# EAGLE design ADXL345_Eval_Board-v11 (EAGLE 5.01)
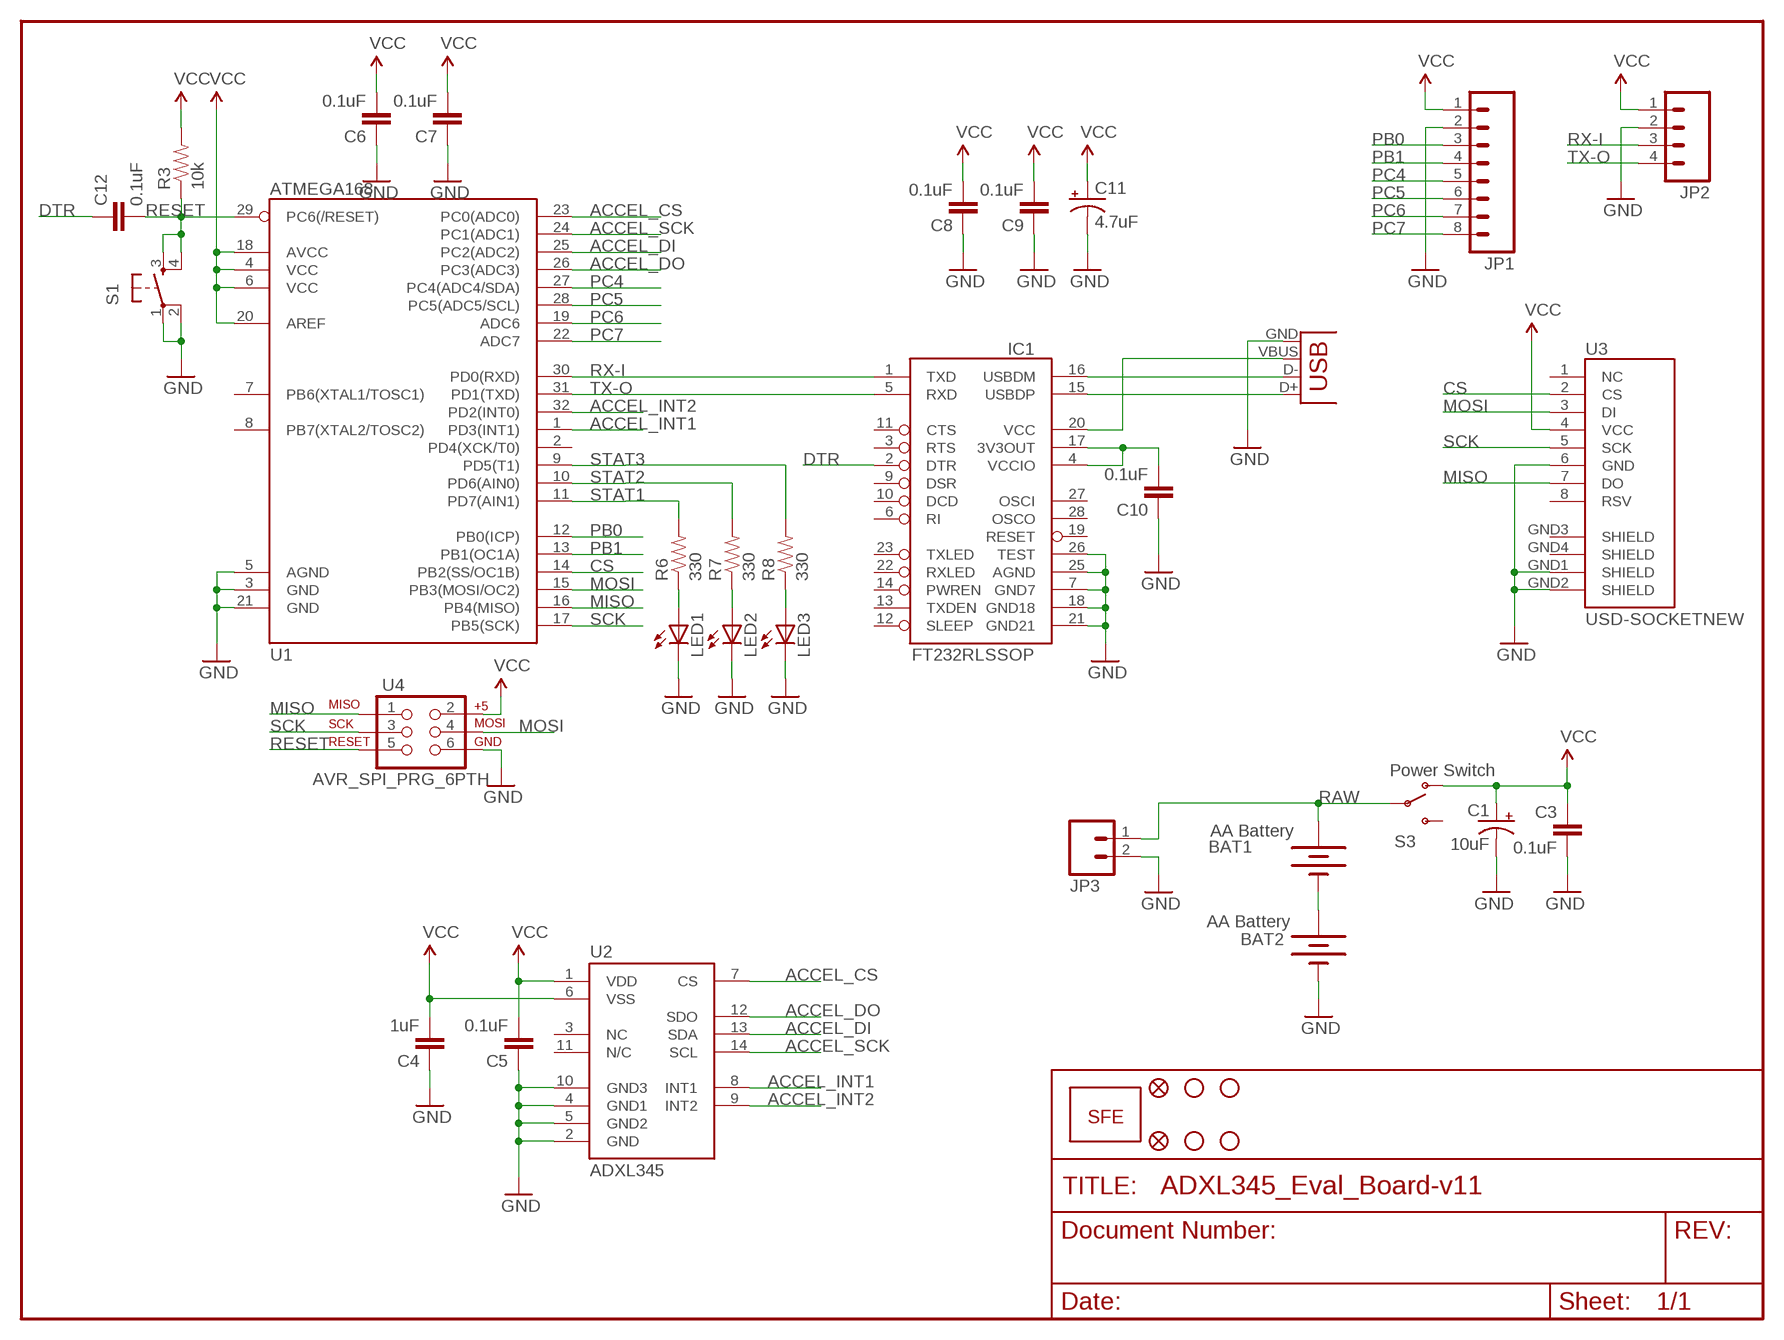
[diagram p0: schematic, sheet 1]

## Parts
BAT1  AA Battery  BATTERYAA  [BATTERY-AA]
BAT2  AA Battery  BATTERYAA  [BATTERY-AA]
C1  10uF  CAP_POL1206  [EIA3216]
C3  0.1uF  CAP0603-CAP  [0603-CAP]
C4  1uF  CAP0805  [0805]
C5  0.1uF  CAP0603-CAP  [0603-CAP]
C6  0.1uF  CAP0603-CAP  [0603-CAP]
C7  0.1uF  CAP0603-CAP  [0603-CAP]
C8  0.1uF  CAP0603-CAP  [0603-CAP]
C9  0.1uF  CAP0603-CAP  [0603-CAP]
C10  0.1uF  CAP0603-CAP  [0603-CAP]
C11  4.7uF  CAP_POL7343  [EIA7343]
C12  0.1uF  CAP0603-CAP  [0603-CAP]
IC1  FT232RLSSOP  [SSOP28DB]
JP1  M08  [1X08]
JP2  M04PTH  [1X04]
JP3  M02PTH  [1X02]
LED1  LED0603  [LED-0603]
LED2  LED0603  [LED-0603]
LED3  LED0603  [LED-0603]
R3  10k  RESISTOR0603-RES  [0603-RES]
R6  330  RESISTOR0603-RES  [0603-RES]
R7  330  RESISTOR0603-RES  [0603-RES]
R8  330  RESISTOR0603-RES  [0603-RES]
S1  TAC_SWITCHSMD  [TACTILE_SWITCH_SMD]
S3  Power Switch  SWITCH-SPSTSMD  [AYZ0202]
U1  ATMEGA168  [TQFP32-08]
U2  ADXL345  [LGA14]
U3  USD-SOCKETNEW  [MICRO-SD-SOCKET-PP]
U4  AVR_SPI_PRG_6PTH  [2X3]
U$1  LOGO-SFENEW  [SFE-NEW-WEBLOGO]
U$2  FIDUCIAL1X2  [FIDUCIAL-1X2]
U$3  FIDUCIAL1X2  [FIDUCIAL-1X2]
U$4  STAND-OFF  [STAND-OFF]
U$5  STAND-OFF  [STAND-OFF]
U$6  STAND-OFF  [STAND-OFF]
U$7  STAND-OFF  [STAND-OFF]
X1  USBSMD  [USB-MINIB]

## Nets
ACCEL_CS: U1.23(PC0(ADC0)) U2.7(CS)
ACCEL_DI: U1.25(PC2(ADC2)) U2.13(SDA)
ACCEL_DO: U1.26(PC3(ADC3)) U2.12(SDO)
ACCEL_INT1: U1.1(PD3(INT1)) U2.8(INT1)
ACCEL_INT2: U1.32(PD2(INT0)) U2.9(INT2)
ACCEL_SCK: U1.24(PC1(ADC1)) U2.14(SCL)
CS: U1.14(PB2(SS/OC1B)) U3.2(CS)
DTR: C12.1 IC1.2(DTR)
GND: BAT2.GND@1(-) C1.C(-) C3.2 C4.1 C5.1 C6.1 C7.1 C8.1 C9.1 C10.1 C11.C(-) IC1.7(GND7) IC1.18(GND18) IC1.21(GND21) IC1.25(AGND) IC1.26(TEST) JP1.2 JP2.2 JP3.2 LED1.C LED2.C LED3.C S1.1 S1.2 U1.3(GND) U1.5(AGND) U1.21(GND) U2.2(GND) U2.4(GND1) U2.5(GND2) U2.10(GND3) U3.6(GND) U3.GND1(SHIELD) U3.GND2(SHIELD) U4.6 X1.GND
MISO: U1.16(PB4(MISO)) U3.7(DO) U4.1
MOSI: U1.15(PB3(MOSI/OC2)) U3.3(DI) U4.4
N$1: LED1.A R6.1
N$2: BAT1.GND@1(-) BAT2.PWR@1(+)
N$3: LED2.A R7.1
N$4: IC1.20(VCC) X1.VBUS
N$5: LED3.A R8.1
N$6: IC1.16(USBDM) X1.D-
N$7: IC1.15(USBDP) X1.D+
N$8: C10.2 IC1.4(VCCIO) IC1.17(3V3OUT)
PB0: JP1.3 U1.12(PB0(ICP))
PB1: JP1.4 U1.13(PB1(OC1A))
PC4: JP1.5 U1.27(PC4(ADC4/SDA))
PC5: JP1.6 U1.28(PC5(ADC5/SCL))
PC6: JP1.7 U1.19(ADC6)
PC7: JP1.8 U1.22(ADC7)
RAW: BAT1.PWR@1(+) JP3.1 S3.2(P)
RESET: C12.2 R3.1 S1.3 S1.4 U1.29(PC6(/RESET)) U4.5
RX-I: IC1.1(TXD) JP2.3 U1.30(PD0(RXD))
SCK: U1.17(PB5(SCK)) U3.5(SCK) U4.3
STAT1: R6.2 U1.11(PD7(AIN1))
STAT2: R7.2 U1.10(PD6(AIN0))
STAT3: R8.2 U1.9(PD5(T1))
TX-O: IC1.5(RXD) JP2.4 U1.31(PD1(TXD))
VCC: C1.A(+) C3.1 C4.2 C5.2 C6.2 C7.2 C8.2 C9.2 C11.A(+) JP1.1 JP2.1 R3.2 S3.1(O) U1.4(VCC) U1.6(VCC) U1.18(AVCC) U1.20(AREF) U2.1(VDD) U2.6(VSS) U3.4(VCC) U4.2
Unconnected: IC1.3(RTS) IC1.6(RI) IC1.9(DSR) IC1.10(DCD) IC1.11(CTS) IC1.12(SLEEP) IC1.13(TXDEN) IC1.14(PWREN) IC1.19(RESET) IC1.22(RXLED) IC1.23(TXLED) IC1.27(OSCI) IC1.28(OSCO) S3.3(S) U1.2(PD4(XCK/T0)) U1.7(PB6(XTAL1/TOSC1)) U1.8(PB7(XTAL2/TOSC2)) U2.3(NC) U2.11(N/C) U3.1(NC) U3.8(RSV) U3.GND3(SHIELD) U3.GND4(SHIELD)

## Library data of the parts
BAT1 BAT2 = SparkFun:BATTERY: Battery Holders Various common sizes : AA, AAA, 20mm coin cell and 12mm coin cell.
C1 C11 = SparkFun:CAP_POL: Capacitor Polarized These are standard SMD and PTH capacitors. Normally 10uF, 47uF, and 100uF in electrolytic and tantalum varieties. Always verify the external diameter of the through hole cap, it varies with capacity, voltage, and manufacturer. The EIA devices should be standard.
C3-C10 C12 = SparkFun:CAP: Capacitor Standard 0603 ceramic capacitor, and 0.1" leaded capacitor.
IC1 = SparkFun:FT232RL: USB UART FT232RL 4th Generation USB UART (USB <-> Serial) Controller. Spark Fun Electronics SKU : COM-00650
JP1 = SparkFun:M08: Header 8 Standard 8-pin 0.1" header. Use with straight break away headers (SKU : PRT-00116), right angle break away headers (PRT-00553), swiss pins (PRT-00743), machine pins (PRT-00117), and female headers (PRT-00115).
JP2 = SparkFun:M04: Header 4 Standard 4-pin 0.1" header. Use with straight break away headers (SKU : PRT-00116), right angle break away headers (PRT-00553), swiss pins (PRT-00743), machine pins (PRT-00117), and female headers (PRT-00115). Molex polarized connector foot print use with SKU : PRT-08231 with associated crimp pins and housings.
JP3 = SparkFun:M02: Header 2 Standard 2-pin 0.1" header. Use with straight break away headers (SKU : PRT-00116), right angle break away headers (PRT-00553), swiss pins (PRT-00743), machine pins (PRT-00117), and female headers (PRT-00115). Molex polarized connector foot print use with SKU : PRT-08233 with associated crimp pins and housings.
LED1-LED3 = SparkFun:LED: LEDs Standard schematic elements and footprints for 5mm, 3mm, 1206, and 0603 sized LEDs. 5mm - Spark Fun Electronics SKU : COM-00529 (and others)
R3 R6-R8 = SparkFun:RESISTOR: Resistor Basic schematic elements and footprints for 0603, 1206, and PTH 1/10th watt (small) resistors.
S1 = SparkFun:TAC_SWITCH: Momentary Switch Button commonly used for reset or general input. Spark Fun Electronics SKU : COM-00097
S3 = SparkFun:SWITCH-SPST: SPST Switch Simple slide switch. Spark Fun Electronics SKU : COM-00102
U1 = SparkFun:ATMEGA168
U2 = SparkFun:ADXL345
U3 = SparkFun:USD-SOCKET: microSD Socket Push-push type uSD socket. Schematic element and footprint production proven. Spark Fun Electronics SKU : PRT-00127. tDoc lines correctly indicate media card edge positions when inserting (unlocked, locked, depressed).
U4 = SparkFun:AVR_SPI_PRG_6: AVR ISP 6 Pin This is the reduced ISP connector for AVR programming. Common on Arduino. This footprint will take up less PCB space and can be used with a 10-pin to 6-pin adapter such as SKU: BOB-08508
U$1 = SparkFun:LOGO-SFE: Spark Fun Electronics PCB Logo This is the standard Spark Fun Electronics PCB logo.
U$2 U$3 = SparkFun:FIDUCIAL: Fiducial Alignment Points Various fiducial points for machine vision alignment.
U$4-U$7 = SparkFun:STAND-OFF: Stand Off This is the mechanical footprint for a #4 phillips button head screw. Use the keepout ring to avoid running the screw head into surrounding components. SKU : PRT-00447
X1 = SparkFun:USB: USB Connectors USB-B-PTH is fully proven SKU : PRT-00139 USB-miniB is fully proven SKU : PRT-00587 USB-A-PCB is untested. USB-A-H is throughly reviewed, but untested. Spark Fun Electronics SKU : PRT-00437 USB-B-SMT is throughly reviewed, but untested. Needs silkscreen touching up. USB-A-S has not been used/tested USB-MB-H has not been used/tested

## Board
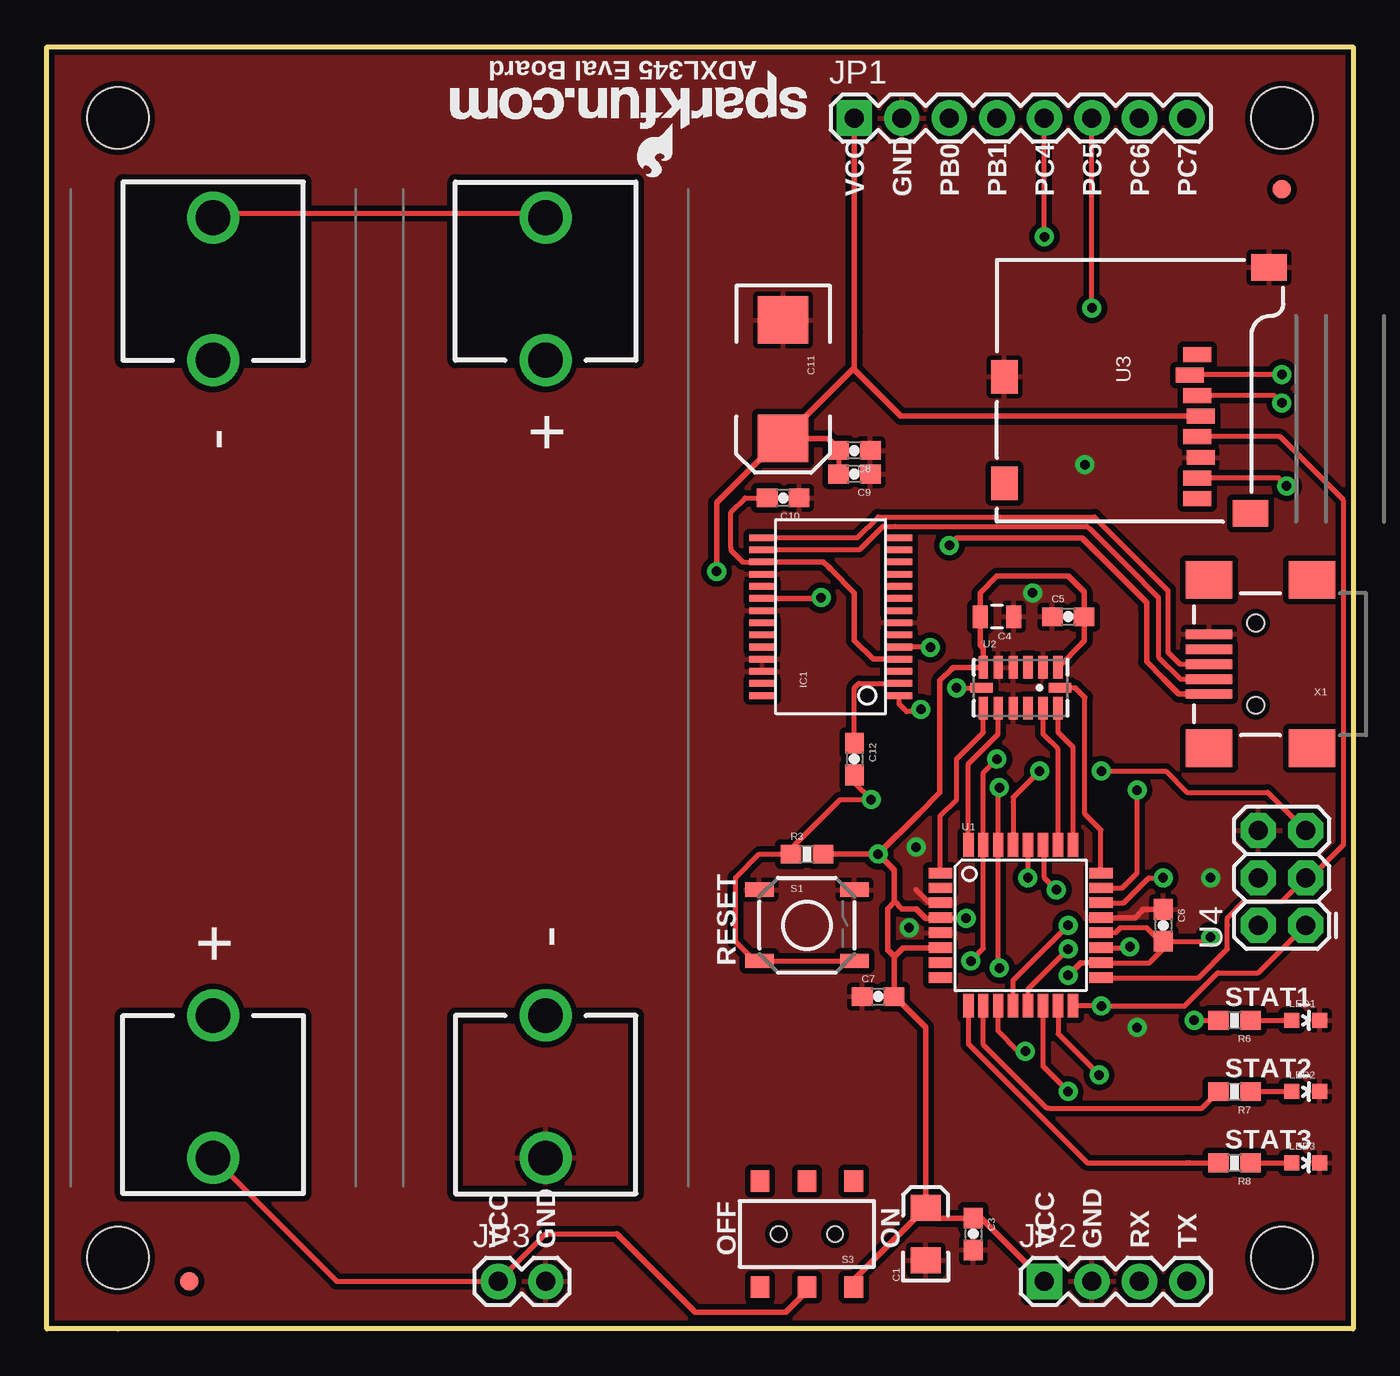
[diagram p1: board, top side]
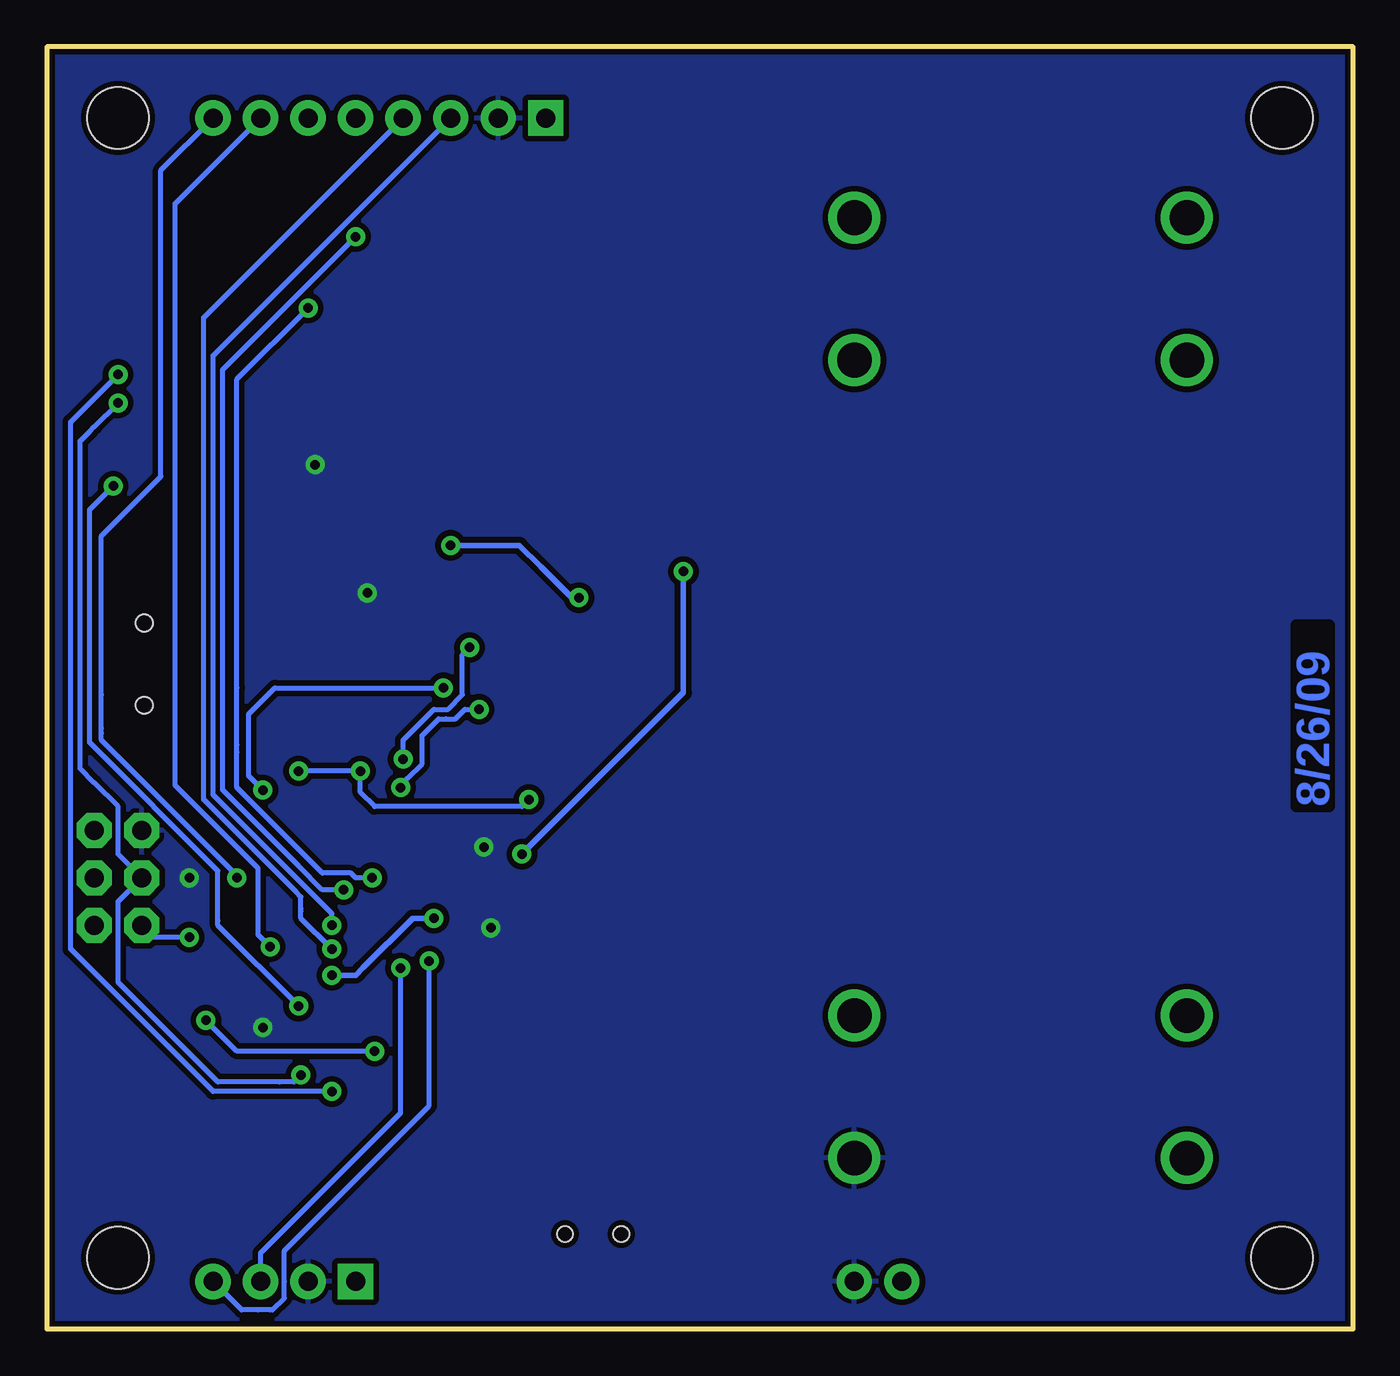
[diagram p2: board, bottom side, seen from below]

Size 69.85 x 68.58 mm. Coordinates in mm from the lower left corner, seen from the top.
Outline: 0,0 0,68.58 69.85,68.58 69.85,0 3.81,0 0,0
Copper layers (1*16): Top 0.035mm / dielectric 1.5mm / Bottom 0.035mm
Design rules "SparkFun": minimum track width 8mil, minimum drill 20mil, track to track 8mil, track to pad 8mil, pad to pad 8mil, via to via 8mil, smd to smd 8mil, copper to edge 10mil, drill to drill 8mil, minimum pad ring 12mil, minimum via ring 10mil, stop-mask expansion 4mil, vias tented up to drill 25mil, thermal gap 10mil

### Footprints (pad centres in the part's own frame; a part is rotated, then mirrored left to right if it is on the bottom)
BATTERY-AA = drill 1.854 round: GND@1 25.146,0; GND@2 17.526,0; PWR@1 -25.146,0; PWR@2 -17.526,0
EIA3216 = smd 1.4 x 1.6: A 1.4,0; C -1.4,0
0603-CAP = smd 1.1 x 1: 1 -0.85,0; 2 0.85,0
0805 = smd 0.8 x 1.2: 1 -0.9,0; 2 0.9,0
EIA7343 = smd 2.55 x 2.7: A 3.17,0; C -3.17,0
SSOP28DB = smd 0.348 x 1.397: 1 -4.225,-3.656; 2 -3.575,-3.656; 3 -2.925,-3.656; 4 -2.275,-3.656; 5 -1.625,-3.656; 6 -0.975,-3.656; 7 -0.325,-3.656; 8 0.325,-3.656; 9 0.975,-3.656; 10 1.625,-3.656; 11 2.275,-3.656; 12 2.925,-3.656; 13 3.575,-3.656; 14 4.225,-3.656; 15 4.225,3.656; 16 3.575,3.656; 17 2.925,3.656; 18 2.275,3.656; 19 1.625,3.656; 20 0.975,3.656; 21 0.325,3.656; 22 -0.325,3.656; 23 -0.975,3.656; 24 -1.625,3.656; 25 -2.275,3.656; 26 -2.925,3.656; 27 -3.575,3.656; 28 -4.225,3.656
1X08 = drill 1.016 pad 1.88 square: 1 0,0 | drill 1.016 pad 1.88 round: 2 2.54,0; 3 5.08,0; 4 7.62,0; 5 10.16,0; 6 12.7,0; 7 15.24,0; 8 17.78,0
1X04 = drill 1.016 pad 1.88 square: 1 0,0 | drill 1.016 pad 1.88 round: 2 2.54,0; 3 5.08,0; 4 7.62,0
1X02 = drill 1.016 pad 1.88 round: 1 0,0; 2 2.54,0
LED-0603 = smd 0.8 x 0.8: A 0,-0.75; C 0,0.75
0603-RES = smd 1.1 x 1: 1 -0.85,0; 2 0.85,0
TACTILE_SWITCH_SMD = smd 1.524 x 0.762: 1 -2.54,1.905; 2 2.54,1.905; 3 -2.54,-1.905; 4 2.54,-1.905
AYZ0202 = smd 1 x 1.15: 1 -2.5,2.825; 2 0,2.825; 3 2.5,2.825; 4 -2.5,-2.825; 5 0,-2.825; 6 2.5,-2.825 | hole 0.85: 1.5,0; -1.5,0
TQFP32-08 = smd 1.27 x 0.559: 1 -4.293,2.8; 2 -4.293,2; 3 -4.293,1.2; 4 -4.293,0.4; 5 -4.293,-0.4; 6 -4.293,-1.2; 7 -4.293,-2; 8 -4.293,-2.8; 17 4.293,-2.8; 18 4.293,-2; 19 4.293,-1.2; 20 4.293,-0.4; 21 4.293,0.4; 22 4.293,1.2; 23 4.293,2; 24 4.293,2.8 | smd 0.559 x 1.27: 9 -2.8,-4.293; 10 -2,-4.293; 11 -1.2,-4.293; 12 -0.4,-4.293; 13 0.4,-4.293; 14 1.2,-4.293; 15 2,-4.293; 16 2.8,-4.293; 25 2.8,4.293; 26 2,4.293; 27 1.2,4.293; 28 0.4,4.293; 29 -0.4,4.293; 30 -1.2,4.293; 31 -2,4.293; 32 -2.8,4.293
LGA14 = smd 0.5 x 1.2: 1 2,1.1; 2 1.2,1.1; 3 0.4,1.1; 4 -0.4,1.1; 5 -1.2,1.1; 6 -2,1.1; 8 -2,-1.1; 9 -1.2,-1.1; 10 -0.4,-1.1; 11 0.4,-1.1; 12 1.2,-1.1; 13 2,-1.1 | smd 1.2 x 0.5: 7 -2.1,0; 14 2.1,0
MICRO-SD-SOCKET-PP = smd 0.8 x 1.5: 1 -8.94,10.7; 2 -7.84,10.3; 3 -6.74,10.7; 4 -5.64,10.9; 5 -4.54,10.7; 6 -3.44,10.9; 7 -2.34,10.7; 8 -1.24,10.7 | smd 1.4 x 1.9: GND1 -13.6,14.55; GND3 -0.45,13.55 | smd 1.8 x 1.4: GND2 -7.75,0.4; GND4 -2.05,0.4
2X3 = drill 1.016 pad 1.88 octagon: 1 0,0; 2 0,2.54; 3 2.54,0; 4 2.54,2.54; 5 5.08,0; 6 5.08,2.54
FIDUCIAL-1X2 = smd 1 x 1: 1 0,0
STAND-OFF = hole 3.302: 0,0
USB-MINIB = smd 2.5 x 0.5: D+ 2.5,0; D- 2.5,0.8; GND 2.5,-1.6; ID 2.5,-0.8; VBUS 2.5,1.6 | smd 2.5 x 2: GND@1 -3,-4.5; GND@2 -3,4.5; GND@3 2.5,4.5; GND@4 2.5,-4.5 | hole 0.9: 0,2.2; 0,-2.2

### Placement (x,y rotation side)
BAT1  8.89,34.29 90 top
BAT2  26.67,34.29 270 top
C1  46.99,5.08 90 top
C3  49.53,5.08 270 top
C4  50.8,38.1 180 top
C5  54.61,38.1 0 top
C6  59.69,21.59 270 top
C7  44.45,17.78 0 top
C8  43.18,46.99 180 top
C9  43.18,45.72 180 top
C10  39.37,44.45 180 top
C11  39.37,50.8 270 top
C12  43.18,30.48 270 top
IC1  41.91,38.1 90 top
JP1  43.18,64.77 0 top
JP2  53.34,2.54 0 top
JP3  24.13,2.54 0 top
LED1  67.31,16.51 270 top
LED2  67.31,12.7 270 top
LED3  67.31,8.89 270 top
R3  40.64,25.4 0 top
R6  63.5,16.51 180 top
R7  63.5,12.7 180 top
R8  63.5,8.89 180 top
S1  40.64,21.59 0 top
S3  40.64,5.08 180 top
U1  52.07,21.59 0 top
U2  52.07,34.29 0 top
U3  50.8,43.18 270 top
U4  67.31,21.59 90 top
U$1  40.64,67.31 180 top
U$2  7.62,2.54 0 top
U$3  66.04,60.96 0 top
U$4  3.81,64.77 0 top
U$5  66.04,3.81 0 top
U$6  66.04,64.77 0 top
U$7  3.81,3.81 0 top
X1  64.64,35.56 180 top

### Tracks (layer width: path | path; a pad name or v marks a point on that pad's centre or on a via)
ACCEL_CS  (via drill 0.51)
  Top 0.254: v48.64,34.29 U2.7 | v58.29,28.83 58.29,24.38 57.53,23.62 57.5,23.59 U1.23
  Bottom 0.254: v48.64,34.29 57.66,34.29 59.05,32.89 59.05,29.59 v58.29,28.83
ACCEL_DI
  Top 0.254: U1.25 54.87,31.11 54.1,31.88 54.07,31.91 U2.13
ACCEL_DO
  Top 0.254: U1.26 54.07,31.02 53.34,31.75 53.27,31.82 U2.12
ACCEL_INT1
  Top 0.254: U1.1 47.78,27.46 48.64,28.32 48.64,30.48 49.28,31.11 50.07,31.91 U2.8
ACCEL_INT2
  Top 0.254: U2.9 50.87,31.82 50.8,31.75 49.53,30.48 49.27,30.22 U1.32
ACCEL_SCK
  Top 0.254: U1.24 56.36,26.7 55.5,27.56 55.5,33.78 54.99,34.29 54.86,34.29 U2.14
CS  (via drill 0.51)
  Top 0.254: U1.14 53.27,14.04 v54.61,12.7 | U3.2 61.1,50.94 60.96,50.8 61.21,51.05 v66.04,51.05
  Bottom 0.254: v54.61,12.7 60.96,12.7 68.58,20.32 68.58,48.51 v66.04,51.05
DTR
  Top 0.254: IC1.2 43.41,34.52 43.18,34.29 C12.1
GND  (via drill 0.51)
  Top 0.254: U1.3 47.19,22.79 46.48,23.5
  Top 0.305: U1.21 58.19,21.99 58.55,22.35 58.63,22.44 C6.1
  other vias: 52.7,39.37 55.5,46.23 46.48,25.78 46.1,21.46 62.23,24.13 58.29,16.13
  pour Top (isolate 0.305): 0,0 0,68.58 69.85,68.58 69.85,0
  pour Bottom (isolate 0.305): 0,0 0,68.58 69.85,68.58 69.85,0
MISO  (via drill 0.51)
  Top 0.254: U4.1 64.77,19.05 62.61,19.05 60.83,17.27 v56.39,17.27 56.36,17.3 U1.16 | U3.7 65.86,45.52 v66.29,45.09
  Bottom 0.254: v56.39,17.27 60.71,21.59 60.71,21.84 60.71,24.51 67.56,31.37 67.56,43.81 66.42,44.96 v66.29,45.09
MOSI  (via drill 0.51)
  Top 0.254: U1.15 54.07,15.78 v56.26,13.59 | U3.3 65.65,49.92 v66.04,49.53
  Bottom 0.254: v66.04,49.53 67.31,48.26 67.56,48.01 68.07,47.5 68.07,32.38 68.07,29.97 67.31,29.21 66.04,27.94 66.04,25.4 U4.4 66.04,22.86 66.04,19.05 66.04,18.54 60.71,13.21 57.4,13.21 56.64,13.21 v56.26,13.59
N$1
  Top 0.254: R6.1 66.04,16.51 66.42,16.51 LED1.A
N$2
  Top 0.254: BAT2.PWR@1 26.67,59.69 9.14,59.69 BAT1.GND@1
N$3
  Top 0.254: LED2.A 66.42,12.7 R7.1
N$4  (via drill 0.51)
  Top 0.305: X1.VBUS 60.53,33.96 59.69,34.8 58.8,35.69 58.8,38.48 58.8,38.86 55.5,42.16 55.37,42.29 51.18,42.29 48.64,42.29 v48.26,41.91 | IC1.20 41.36,39.08 v41.4,39.12
  Bottom 0.305: v48.26,41.91 44.58,41.91 43.43,40.77 41.78,39.12 v41.4,39.12
N$5
  Top 0.254: LED3.A 66.42,8.89 R8.1
N$6
  Top 0.254: IC1.16 42.31,41.67 43.45,41.67 44.2,42.42 44.7,42.93 45.34,42.93 55.63,42.93 55.75,42.8 57.78,40.77 59.44,39.12 59.44,37.34 59.44,36.96 59.44,35.94 60.62,34.76 X1.D-
N$7
  Top 0.254: IC1.15 43.34,42.33 44.45,43.43 56.01,43.43 59.94,39.5 59.94,39.12 59.94,36.2 60.58,35.56 X1.D+
N$8
  Top 0.254: IC1.17 37.21,41.02 36.58,41.66 36.58,41.78 36.58,43.69 37.34,44.45 C10.2
  Top 0.305: IC1.4 44.19,35.83 43.18,36.83 43.18,39.37 41.91,40.64 41.78,40.77 41.52,41.02 IC1.17
PB0  (via drill 0.51)
  Top 0.254: U1.12 51.67,18.65 v54.61,21.59
  Bottom 0.254: JP1.3 60.96,52.07 60.96,39.37 60.96,38.86 60.96,28.57 55.88,23.5 54.61,22.23 v54.61,21.59
PB1  (via drill 0.51)
  Top 0.254: U1.13 52.47,18.18 v54.61,20.32
  Bottom 0.254: JP1.4 61.47,54.1 61.47,28.32 56.52,23.37 56.26,23.11 56.26,22.48 56.26,22.35 56.26,21.97 v54.61,20.32
PC4  (via drill 0.51)
  Top 0.254: U1.27 53.34,25.81 53.34,24.13 v53.98,23.5 | JP1.5 53.47,64.77 53.34,64.64 v53.34,58.42
  Bottom 0.254: v53.98,23.5 54.48,23.5 55.12,23.5 56.39,24.77 60.45,28.83 60.45,32 60.45,32.13 60.45,51.31 v53.34,58.42
PC5  (via drill 0.51)
  Top 0.254: v55.88,54.61 JP1.6 | U1.28 52.47,24.15 v52.45,24.13
  Bottom 0.254: v55.88,54.61 59.69,50.8 59.69,34.29 59.69,31.24 59.69,30.86 59.69,28.96 55.88,25.15 55.12,24.38 53.59,24.38 53.34,24.13 v52.45,24.13
PC6  (via drill 0.51)
  Top 0.254: U1.19 57.85,20.39 v57.91,20.45
  Bottom 0.254: JP1.7 62.99,60.2 62.99,29.08 58.93,25.02 58.55,24.64 58.55,21.08 v57.91,20.45
PC7  (via drill 0.51)
  Top 0.254: U1.22 57.59,22.79 58.93,24.13 v59.69,24.13
  Bottom 0.254: JP1.8 63.75,61.98 63.75,45.59 66.93,42.42 66.93,33.91 66.93,32.13 66.93,31.88 66.93,31.5 64.77,29.34 61.09,25.65 59.69,24.26 v59.69,24.13
RAW
  Top 0.254: 30.48,5.08 26.67,5.08 JP3.1 15.49,2.54 BAT1.PWR@1
  Top 0.305: 30.48,5.08 34.67,0.89 39.5,0.89 40.77,2.16 40.67,2.25 S3.2
RESET  (via drill 0.51)
  Top 0.254: U1.29 51.67,28.18 51.67,28.43 v53.09,29.84 | v56.39,29.84 59.82,29.84 60.96,28.7 65.28,28.7 U4.5 | C12.2 43.18,29.59 43.14,29.63 | S1.4 S1.3 37.85,19.68 36.83,20.7 36.83,24.13 38.1,25.4 R3.1 39.79,25.69 40.51,26.42 40.64,26.54 41.91,27.81 42.42,28.32 43.81,28.32 v44.07,28.32 43.18,29.21 | 43.18,29.21 C12.2 | 43.18,29.21 C12.2
  Bottom 0.254: v56.39,29.84 v53.09,29.84 53.09,28.7 52.32,27.94 44.45,27.94 v44.07,28.32
RX-I  (via drill 0.51)
  Top 0.254: v50.93,28.96 50.87,28.9 U1.30 50.87,19.36 v50.93,19.3 | IC1.1 45.57,33.43 45.97,33.02 46.61,33.02 v46.74,33.15
  Bottom 0.254: v50.93,28.96 50.93,29.08 50.55,29.46 49.78,30.23 49.78,31.75 48.89,32.64 48.51,32.64 48.01,32.64 47.5,33.15 v46.74,33.15 | v50.93,19.3 50.93,11.56 58.42,4.06 JP2.3
SCK
  Top 0.254: U1.17 61.59,18.79 63.12,20.32 63.12,21.59 63.12,21.97 64.01,22.86 64.39,22.86 66.04,22.86 U4.3 67.56,24.13 69.09,25.65 69.34,25.91 69.34,28.7 69.34,33.15 69.34,44.32 65.95,47.72 65.88,47.72 U3.5
STAT1  (via drill 0.51)
  Top 0.254: U1.11 50.87,15.93 51.94,14.86 v52.32,14.86 | v61.34,16.51 R6.2
  Bottom 0.254: v52.32,14.86 59.69,14.86 v61.34,16.51
STAT2
  Top 0.254: U1.10 50.07,15.21 53.47,11.81 53.59,11.81 61.76,11.81 R7.2
STAT3
  Top 0.254: U1.9 49.27,15.25 52.7,11.81 55.63,8.89 60.96,8.89 61.09,8.89 R8.2
TX-O  (via drill 0.51)
  Top 0.254: v50.8,30.48 50.07,29.75 U1.31 50.07,20.35 v49.4,19.68 | IC1.5 47.22,36.48 v47.24,36.45
  Bottom 0.254: v50.8,30.48 50.8,31.5 49.15,33.15 48.39,33.15 47.62,33.91 47.62,36.07 v47.24,36.45 | v49.4,19.68 49.4,11.94 57.15,4.19 57.15,2.54 57.15,1.65 57.78,1.02 57.91,1.02 58.55,1.02 59.44,1.02 JP2.4
VCC  (via drill 0.51)
  Top 0.254: 59.69,20.32 C6.2 | 59.05,19.68 59.69,20.32 | 58.96,19.59 59.05,19.68 | 59.69,20.32 C6.2 | C6.2 62.02,20.74 v62.23,20.95 | U1.20 57.13,21.19 57.4,21.46 58.8,21.46 59.56,20.7 59.6,20.74 C6.2 | C9.2 42.29,45.72 42.33,45.76 C8.2 | U1.18 58.96,19.59 | 58.96,19.59 59.05,19.68
  Top 0.305: C1.A | S3.1 43.14,2.63 C1.A | C1.A | C1.A 47.54,5.93 C3.1 49.95,5.93 JP2.1 | C11.A 43.11,51.37 | 43.11,51.37 43.18,51.44 43.18,53.34 JP1.1 | C11.A 39.25,47.63 39.24,47.62 35.81,44.2 v35.81,40.51 | U2.1 55.37,36.69 55.37,36.7 55.46,36.79 C5.2 55.46,39.41 54.61,40.26 50.93,40.26 50.8,40.26 49.9,39.36 C4.2 49.9,36.59 49.91,36.58 50.07,36.42 U2.6 48.47,35.39 48.39,35.31 47.75,34.67 47.75,34.54 47.75,28.7 46.61,27.56 v44.45,25.4 | 43.11,51.37 43.18,51.31 45.67,48.82 U3.4 | C8.2 42.42,46.99 41.78,47.63 C11.A | 45.3,19.94 C7.2 45.34,17.78 46.99,16.13 C1.A | v44.45,25.4 R3.2 | U1.18 55.28,19.59 v54.61,18.92 | 47.8,21.97 U1.4 | 47.8,21.97 v49.15,21.97 | 45.3,19.94 45.34,19.94 45.79,20.39 U1.6 | v44.45,25.4 45.3,24.55 45.3,23.62 45.3,22.86 45.34,22.86 | 47.8,21.97 46.99,21.97 46.48,22.48 45.72,22.48 45.34,22.86 | 45.3,19.94 44.96,20.28 44.96,21.08 44.96,22.48 45.34,22.86
  Bottom 0.254: v62.23,20.95 64.14,20.95 U4.2
  Bottom 0.305: v54.61,18.92 53.34,18.92 52.96,19.3 50.29,21.97 v49.15,21.97 | v35.81,40.51 35.81,34.04 v44.45,25.4

### Text on the board
Bottom: 8/26/09
tPlace: ADXL345 Eval Board | VCC | GND | PB0 | PB1 | PC4 | PC5 | PC6 | PC7 | RESET | STAT1 | STAT2 | STAT3 | VCC | GND | OFF | ON | VCC | GND | RX | TX